# Altium schematic sheet 47uf.schdoc
size 49 x 26 mm
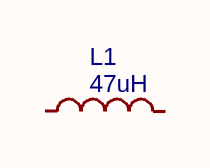
[diagram p0: 47uf.schdoc]

## Parts
L1  47uH  [IND-SMD_L12.6-W12.6_MCF-13XX]

## Nets

Not connected (* = marked no-connect by the designer): L1 1 2

## Library data of the parts
L1 = 47uH: BOM_Manufacturer: YJYCOIN; BOM_Manufacturer Part: YSPI1365-470M; nameAlias: Inductance; Contributor: LCSC; BOM_Supplier: LCSC; BOM_Supplier Part: C497913; BOM_JLCPCB Part Class: Extended Part; spicePre: L; spiceSymbolName: YSPI1365-470M